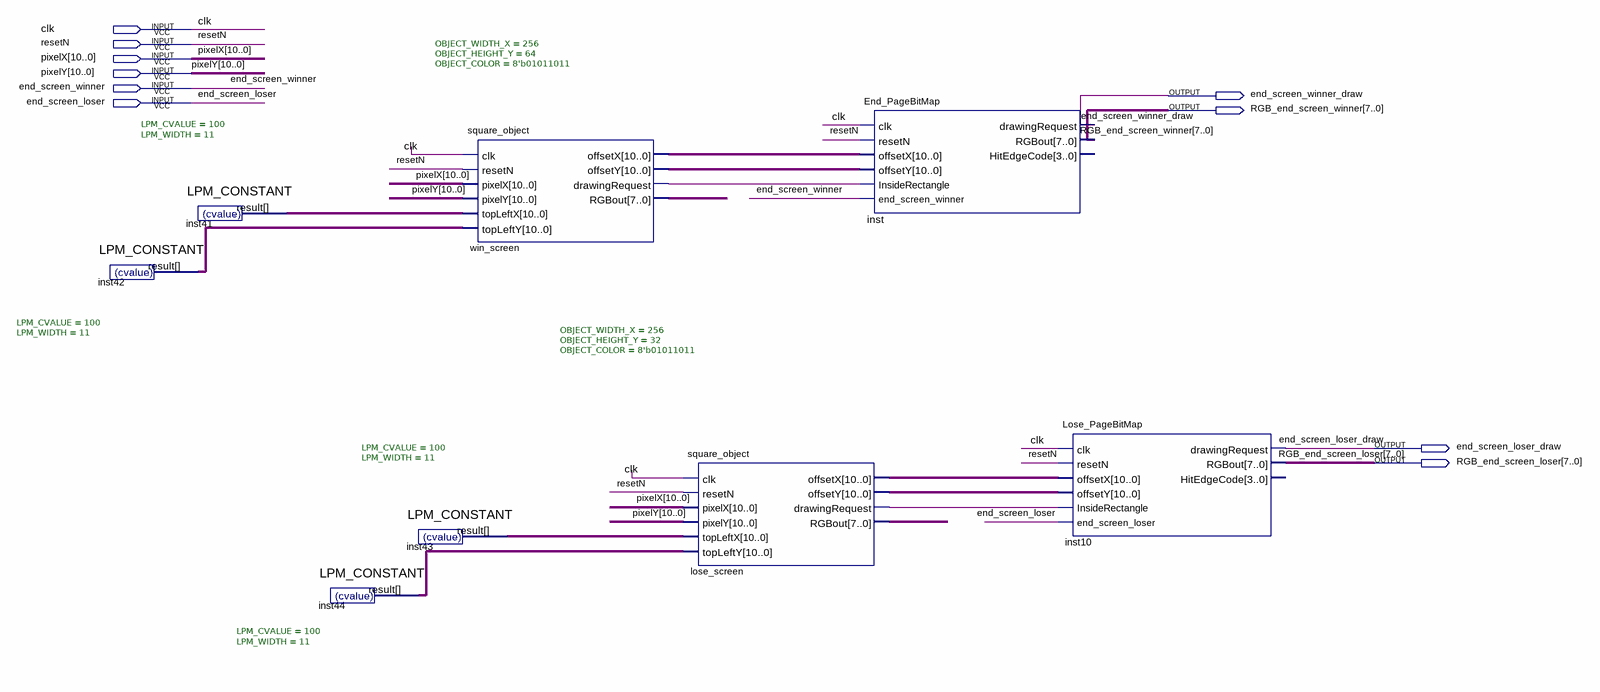
[diagram p0: schematic sheet]
// Quartus schematic end_page.bdf as structural Verilog: 8 symbols, 10 pins
module end_page (
  input  clk,
  input  resetN,
  input  [10:0] pixelX,
  input  [10:0] pixelY,
  input  end_screen_winner,
  input  end_screen_loser,
  output end_screen_winner_draw,
  output [7:0] RGB_end_screen_winner,
  output end_screen_loser_draw,
  output [7:0] RGB_end_screen_loser
);

  wire lose_screen_drawingrequest, win_screen_drawingrequest;
  wire [7:0] lose_screen_rgbout, win_screen_rgbout;
  wire [10:0] inst41_result, inst42_result, inst43_result, inst44_result, lose_screen_offsetx,
       lose_screen_offsety, win_screen_offsetx, win_screen_offsety;

  LPM_CONSTANT #(.LPM_CVALUE(100), .LPM_WIDTH(11)) inst42 (.result(inst42_result));
  LPM_CONSTANT #(.LPM_CVALUE(100), .LPM_WIDTH(11)) inst41 (.result(inst41_result));
  LPM_CONSTANT #(.LPM_CVALUE(100), .LPM_WIDTH(11)) inst44 (.result(inst44_result));
  LPM_CONSTANT #(.LPM_CVALUE(100), .LPM_WIDTH(11)) inst43 (.result(inst43_result));
  square_object #(.OBJECT_WIDTH_X(256), .OBJECT_HEIGHT_Y(64), .OBJECT_COLOR(8'b01011011)) win_screen (
    .clk(clk), .resetN(resetN), .pixelX(pixelX), .pixelY(pixelY), .topLeftX(inst41_result),
    .topLeftY(inst42_result), .offsetX(win_screen_offsetx), .offsetY(win_screen_offsety),
    .drawingRequest(win_screen_drawingrequest), .RGBout(win_screen_rgbout));
  square_object #(.OBJECT_WIDTH_X(256), .OBJECT_HEIGHT_Y(32), .OBJECT_COLOR(8'b01011011)) lose_screen (
    .clk(clk), .resetN(resetN), .pixelX(pixelX), .pixelY(pixelY), .topLeftX(inst43_result),
    .topLeftY(inst44_result), .offsetX(lose_screen_offsetx), .offsetY(lose_screen_offsety),
    .drawingRequest(lose_screen_drawingrequest), .RGBout(lose_screen_rgbout));
  End_PageBitMap inst (
    .clk(clk), .resetN(resetN), .offsetX(win_screen_offsetx), .offsetY(win_screen_offsety),
    .InsideRectangle(win_screen_drawingrequest), .end_screen_winner(end_screen_winner),
    .drawingRequest(end_screen_winner_draw), .RGBout(RGB_end_screen_winner));  // open: HitEdgeCode
  Lose_PageBitMap inst10 (
    .clk(clk), .resetN(resetN), .offsetX(lose_screen_offsetx), .offsetY(lose_screen_offsety),
    .InsideRectangle(lose_screen_drawingrequest), .end_screen_loser(end_screen_loser),
    .drawingRequest(end_screen_loser_draw), .RGBout(RGB_end_screen_loser));  // open: HitEdgeCode
endmodule
